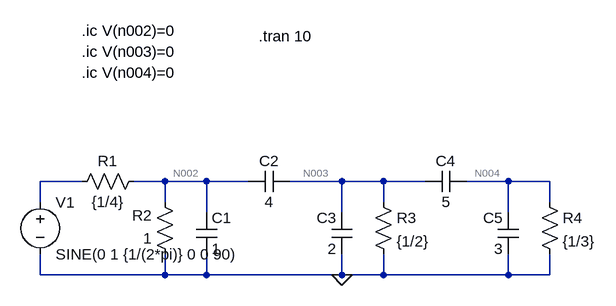
[diagram p0: schematic ejemplo32.asc]
ejemplo32.asc, the LTspice schematic file:
Version 4
SHEET 1 880 680
WIRE 48 112 -16 112
WIRE 176 112 128 112
WIRE 240 112 176 112
WIRE 304 112 240 112
WIRE 448 112 368 112
WIRE 512 112 448 112
WIRE 576 112 512 112
WIRE 704 112 640 112
WIRE 768 112 704 112
WIRE -16 144 -16 112
WIRE 176 144 176 112
WIRE 512 144 512 112
WIRE 768 144 768 112
WIRE 240 160 240 112
WIRE 448 160 448 112
WIRE 704 160 704 112
WIRE -16 256 -16 224
WIRE 176 256 176 224
WIRE 176 256 -16 256
WIRE 240 256 240 224
WIRE 240 256 176 256
WIRE 448 256 448 224
WIRE 448 256 240 256
WIRE 512 256 512 224
WIRE 512 256 448 256
WIRE 704 256 704 224
WIRE 704 256 512 256
WIRE 768 256 768 224
WIRE 768 256 704 256
FLAG 448 256 0
SYMBOL voltage -16 128 R0
WINDOW 123 0 0 Left 0
WINDOW 39 0 0 Left 0
SYMATTR InstName V1
SYMATTR Value SINE(0 1 {1/(2*pi)} 0 0 90)
SYMBOL res 144 96 R90
WINDOW 0 0 56 VBottom 2
WINDOW 3 32 56 VTop 2
SYMATTR InstName R1
SYMATTR Value {1/4}
SYMBOL res 192 240 R180
WINDOW 0 36 76 Left 2
WINDOW 3 36 40 Left 2
SYMATTR InstName R2
SYMATTR Value 1
SYMBOL cap 224 160 R0
SYMATTR InstName C1
SYMATTR Value 1
SYMBOL cap 368 96 R90
WINDOW 0 0 32 VBottom 2
WINDOW 3 32 32 VTop 2
SYMATTR InstName C2
SYMATTR Value 4
SYMBOL cap 464 224 R180
WINDOW 0 24 56 Left 2
WINDOW 3 24 8 Left 2
SYMATTR InstName C3
SYMATTR Value 2
SYMBOL res 496 128 R0
SYMATTR InstName R3
SYMATTR Value {1/2}
SYMBOL cap 640 96 R90
WINDOW 0 0 32 VBottom 2
WINDOW 3 32 32 VTop 2
SYMATTR InstName C4
SYMATTR Value 5
SYMBOL cap 720 224 R180
WINDOW 0 24 56 Left 2
WINDOW 3 24 8 Left 2
SYMATTR InstName C5
SYMATTR Value 3
SYMBOL res 752 128 R0
SYMATTR InstName R4
SYMATTR Value {1/3}
TEXT 48 -120 Left 2 !.ic V(n002)=0
TEXT 48 -88 Left 2 !.ic V(n003)=0
TEXT 48 -56 Left 2 !.ic V(n004)=0
TEXT 320 -112 Left 2 !.tran 10

The netlist it stands for:
* ejemplo32.asc
V1 N001 0 SINE(0 1 {1/(2*pi)} 0 0 90)
R1 N002 N001 {1/4}
R2 0 N002 1
C1 N002 0 1
C2 N003 N002 4
C3 0 N003 2
R3 N003 0 {1/2}
C4 N004 N003 5
C5 0 N004 3
R4 N004 0 {1/3}
.ic V(n002)=0
.ic V(n003)=0
.ic V(n004)=0
.tran 10
.backanno
.end